# EAGLE design Adafruit_BQ24074 (EAGLE 9.6.2)
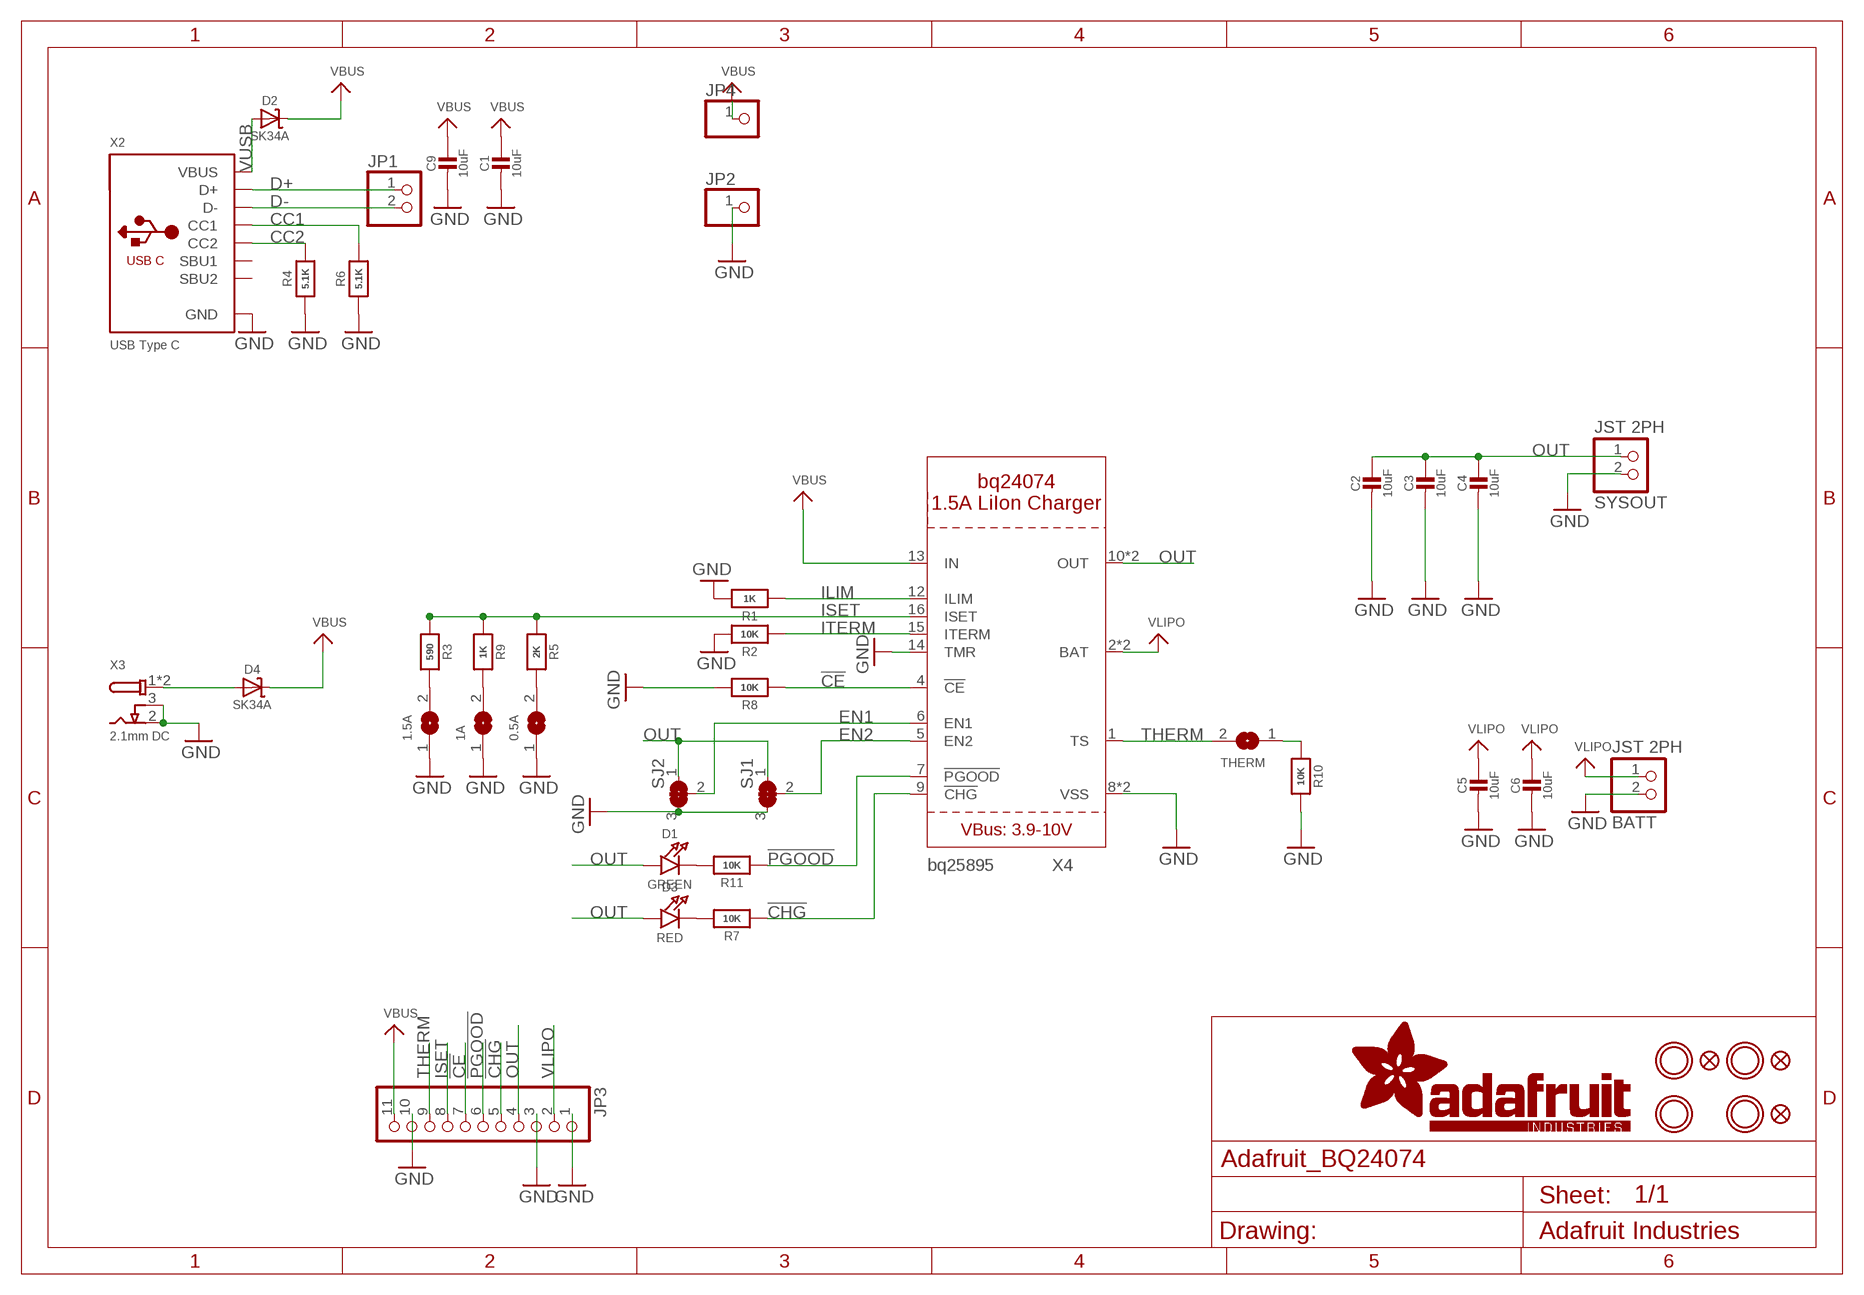
[diagram p0: schematic, sheet 1]

## Parts
0.5A  SOLDERJUMPER  [SOLDERJUMPER_ARROW_NOPASTE]
1.5A  SOLDERJUMPER  [SOLDERJUMPER_ARROW_NOPASTE]
1A  SOLDERJUMPERCLOSED  [SOLDERJUMPER_CLOSEDWIRE]
BATT  JST 2PH  JST_2PIN-SMT-RA  [JST-PH-2-SMT-RA]
C1  10uF  CAP_CERAMIC0805-NOOUTLINE  [0805-NO]
C2  10uF  CAP_CERAMIC0805-NOOUTLINE  [0805-NO]
C3  10uF  CAP_CERAMIC0805-NOOUTLINE  [0805-NO]
C4  10uF  CAP_CERAMIC0805-NOOUTLINE  [0805-NO]
C5  10uF  CAP_CERAMIC0805-NOOUTLINE  [0805-NO]
C6  10uF  CAP_CERAMIC0805-NOOUTLINE  [0805-NO]
C9  10uF  CAP_CERAMIC0805-NOOUTLINE  [0805-NO]
D1  GREEN  LED0603  [CHIPLED_0603]
D2  SK34A  DIODE-SCHOTTKYSMA  [SMADIODE]
D3  RED  LED0603  [CHIPLED_0603]
D4  SK34A  DIODE-SCHOTTKYSMA  [SMADIODE]
FID1  FIDUCIAL_1MM  [FIDUCIAL_1MM]
FID2  FIDUCIAL_1MM  [FIDUCIAL_1MM]
FID3  FIDUCIAL_1MM  [FIDUCIAL_1MM]
JP1  HEADER-1X2ROUND  [1X02_ROUND]
JP2  HEADER-1X1  [1X01_OVAL]
JP3  HEADER-1X1176MIL  [1X11_ROUND_76]
JP4  HEADER-1X1  [1X01_OVAL]
R1  1K  RESISTOR_0603_NOOUT  [0603-NO]
R2  10K  RESISTOR_0603_NOOUT  [0603-NO]
R3  590  RESISTOR_0603_NOOUT  [0603-NO]
R4  5.1K  RESISTOR_0603_NOOUT  [0603-NO]
R5  2K  RESISTOR_0603_NOOUT  [0603-NO]
R6  5.1K  RESISTOR_0603_NOOUT  [0603-NO]
R7  10K  RESISTOR_0603_NOOUT  [0603-NO]
R8  10K  RESISTOR_0603_NOOUT  [0603-NO]
R9  1K  RESISTOR_0603_NOOUT  [0603-NO]
R10  10K  RESISTOR_0603_NOOUT  [0603-NO]
R11  10K  RESISTOR_0603_NOOUT  [0603-NO]
SJ1  SOLDERJUMPER_2WAY  [SOLDERJUMPER_2WAY_OPEN_NOPASTE]
SJ2  SOLDERJUMPER_2WAY  [SOLDERJUMPER_2WAY_OPEN_NOPASTE]
SYSOUT  JST 2PH  JST_2PIN-SMT-RA  [JST-PH-2-SMT-RA]
THERM  SOLDERJUMPERCLOSED  [SOLDERJUMPER_CLOSEDWIRE]
U$3  MOUNTINGHOLE2.5  [MOUNTINGHOLE_2.5_PLATED]
U$4  MOUNTINGHOLE2.5  [MOUNTINGHOLE_2.5_PLATED]
U$11  MOUNTINGHOLE2.5  [MOUNTINGHOLE_2.5_PLATED]
U$12  MOUNTINGHOLE2.5  [MOUNTINGHOLE_2.5_PLATED]
X2  USB Type C  USB_C  [USB_C_CUSB31-CFM2AX-01-X]
X3  2.1mm DC  DCBARRELSMT  [DCJACK_2MM_SMT]
X4  BQ24074  [QFN16_3MM]

## Nets
!CE: JP3.7 R8.1 X4.4(!CE)
!CHG: JP3.5 R7.1 X4.9(!CHG)
!PGOOD: JP3.6 R11.1 X4.7(!PGOOD)
CC1: R6.2 X2.A5(CC1)
CC2: R4.2 X2.B5(CC2)
D+: JP1.1 X2.A6(D+) X2.B6(D+)
D-: JP1.2 X2.A7(D-) X2.B7(D-)
EN1: SJ2.2 X4.6(EN1)
EN2: SJ1.2 X4.5(EN2)
GND: 0.5A.1 1.5A.1 1A.1 BATT.2 C1.2 C2.2 C3.2 C4.2 C5.2 C6.2 C9.2 JP2.1 JP3.1 JP3.3 JP3.10 R1.2 R2.2 R4.1 R6.1 R8.2 R10.2 SJ1.3 SJ2.3 SYSOUT.2 X2.A1B12(GND) X2.B1A12(GND) X3.2(GND) X3.3(GNDBREAK) X4.8(VSS) X4.14(TMR) X4.THERMAL(VSS)
ILIM: R1.1 X4.12(ILIM)
ISET: JP3.8 R3.1 R5.1 R9.1 X4.16(ISET)
ITERM: R2.1 X4.15(ITERM)
N$1: D1.C R11.2
N$2: D4.A X3.1'(PWR) X3.1(PWR)
N$3: D3.C R7.2
N$5: 1.5A.2 R3.2
N$6: 0.5A.2 R5.2
N$7: 1A.2 R9.2
N$9: R10.1 THERM.1
OUT: C2.1 C3.1 C4.1 D1.A D3.A JP3.4 SJ1.1 SJ2.1 SYSOUT.1 X4.10(OUT) X4.11(OUT)
THERM: JP3.9 THERM.2 X4.1(TS)
VBUS: C1.1 C9.1 D2.C D4.C JP3.11 JP4.1 X4.13(IN)
VLIPO: BATT.1 C5.1 C6.1 JP3.2 X4.2(BAT) X4.3(BAT)
VUSB: D2.A X2.A4B9(VBUS) X2.B4A9(VBUS)
Unconnected: X2.A8(SBU1) X2.B8(SBU2)

## Library data of the parts
0.5A 1.5A = microbuilder:SOLDERJUMPER: SMD Solder JUMPER Solder the two pads together to create a connection, or remove the solder to break it. REFLOW - Use this footprint for solder paste and reflow ovens. WAVE - Use this footprint for hand-soldering (larger pads). CLOSED - Has a trace between the two pads to ensure it is closed by default. The trace needs to be cut to disable the jumper, and can be closed again by creating a solder bridge between the two pads.; BOM: EXCLUDE
1A THERM = microbuilder:SOLDERJUMPER: SMD Solder JUMPER Solder the two pads together to create a connection, or remove the solder to break it. REFLOW - Use this footprint for solder paste and reflow ovens. WAVE - Use this footprint for hand-soldering (larger pads). CLOSED - Has a trace between the two pads to ensure it is closed by default. The trace needs to be cut to disable the jumper, and can be closed again by creating a solder bridge between the two pads.
BATT SYSOUT = adafruit:JST_2PIN: JST 2-Pin Connectors of various flavors SMT-RA (S2B-PH-SM4) 4UConnector #17311 SMT (B2B-PH-SM4) THM-RA (S2B-PH) THM (B2B-PH)
C1-C6 C9 = microbuilder:CAP_CERAMIC: Ceramic Capacitors For new designs, use the packages preceded by an '_' character since they are more reliable: The following footprints should be used on most boards: _0402 - Standard footprint for regular board layouts _0603 - Standard footprint for regular board layouts _0805 - Standard footprint for regular board layouts _1206 - Standard footprint for regular board layouts For extremely tight-pitch boards where space is at a premium, the following 'micro-pitch' footprints can be used (smaller pads, no silkscreen outline, etc.): _0402MP - Micro-pitch footprint for very dense/compact boards _0603MP - Micro-pitch footprint for very dense/compact boards _0805MP - Micro-pitch footprint for very dense/compact boards _1206MP - Micro-pitch footprint for very dense/compact boards
D1 D3 = microbuilder:LED: LED 0603 - 0603 Surface Mount Package 2mA: Green LED - Low Power (3.9mcd, 2ma, 1.7Vf) - Digikey: 475-2709-2-ND Orange LED - Low Power (9.8mcd, 2ma, 1.8Vf) - Digikey: 475-1194-2-ND Red LED - Low Power (5mcd, 2ma, 1.8Vf) - Digikey: 475-1195-2-ND Yellow LED - Low Power (7mcd, 2ma, 1.8Vf) - Digikey: 475-1196-2-ND 5mA: Blue LED - Low Power (17mcd, 5ma, 2.9Vf) - Digikey: LNJ937W8CRACT-ND 0805 - 0805 Surface Mount Package 2mA: Red LED (8.8mcd, 2mA, 1.8Vf, Clear) - Low Power [Digikey: 475-2510-1-ND] Green LED (5mcd, 2mA, 1.8Vf, Clear) - Low Power [Digikey: 475-2730-1-ND] Yellow LED (11.3mcd, 2mA, 1.8Vf, Clear) - Low Power [Digikey: 475-2555-1-ND] 20mA: Red LED (104mcd, 20mA, Diffused) - LS R976 [Digikey: 475-1278-6-ND] Red LED (12mcd, 20mA, 2.0Vf, Clear) - APT2012EC [Digikey: 754-1128-1-ND] Green LED (15mcd, 20mA, 2.2Vf, Clear) - APT2012GC [Digikey: 754-1131-1-ND] Orange LED (160mcd, 20mA, 2.1Vf, Clear) - APT2012SECK [Digikey: 754-1130-1-ND] 1206 - 1206 Surface Mount Package Green LED (26mcd, 20mA, Diffused) - LG N971 [Digikey: 475-1407-6-ND] Red LED (15mcd, 20mA, Diffused) - LH N974 [Digikey: 475-1416-6-ND] Cree - Cree High-Power Surface Mount LEDs XPEBWT-L1-0000-00D50 - White 111lm 350mA 2.9Vf 6200K 110° XTEAWT-00-0000-00000LEE3 - White 114lm 350mA 2.85Vf 5000K 115° Everlight - Everlight 45-21 Series Surface Mount LEDs 45-21/QK2C-B2832AC2CB2/2T - Warm White 2000mcd 20mA 3.25Vf 3050K 120° 45-21/LK2C-B38452C4CB2/2T - Nuetral White 2000mcd 20mA 3.25Vf 4150K 120° 45-21/LK2C-B50634C6CB2/2T - Cold White 2200mcd 20mA 3.25Vf 5650K 120° PLCC2 Reverse Mount LS T77K-J1L2-1-0-2-R18-Z - Red 11.25mcd 2mA 1.8Vf 630nm 120° LO T77K-L1M2-24-Z - Orange 19.6mcd 2mA 1.8Vf 606nm 120° LY T77K-K2M1-26-Z - Yellow 15.7mcd 2mA 1.8Vf 587nm 120°
D2 D4 = microbuilder:DIODE-SCHOTTKY
FID1-FID3 = microbuilder:FIDUCIAL: Fiducial Alignment Points Various fiducial points for machine vision alignment.; BOM: EXCLUDE
JP1 = microbuilder:HEADER-1X2: PIN HEADER
JP2 JP4 = microbuilder:HEADER-1X1: PIN HEADER
JP3 = microbuilder:HEADER-1X11
R1-R11 = microbuilder:RESISTOR: Resistors For new designs, use the packages preceded by an '_' character since they are more reliable: The following footprints should be used on most boards: _0402 - Standard footprint for regular board layouts _0603 - Standard footprint for regular board layouts _0805 - Standard footprint for regular board layouts _1206 - Standard footprint for regular board layouts For extremely tight-pitch boards where space is at a premium, the following 'micro-pitch' footprints can be used (smaller pads, no silkscreen outline, etc.): _0402MP - Micro-pitch footprint for very dense/compact boards _0603MP - Micro-pitch footprint for very dense/compact boards _0805MP - Micro-pitch footprint for very dense/compact boards _1206MP - Micro-pitch footprint for very dense/compact boards
SJ1 SJ2 = microbuilder:SOLDERJUMPER_2WAY: 2-Way Solder Jumper
U$3 U$4 U$11 U$12 = microbuilder:MOUNTINGHOLE: Mounting Hole For #2 screws (0.086"/2.18mm width, 0.094"/2.4mm hole) use 2.5mm; BOM: EXCLUDE
X2 = microbuilder:USB_C: USB Type-C USB 2.0 Connector
X3 = microbuilder:DCBARREL: DC Barrel Jack DCJACK_1.3MM_PTH - Through Hole 1.3mm Jack (4UConnector: 05536) DCJACK_2MM_PTH - Through Hole 2.0/2.1 Jack (4UConnector: 05537) DCJACK_2MM_SMT - SMT 2.0/2.1mm Jack(4UConnector: 03267)
X4 = adafruit_power:BQ24074

## Net classes
1 highpower: width 0.305 mm, drill 0.483 mm

## Board
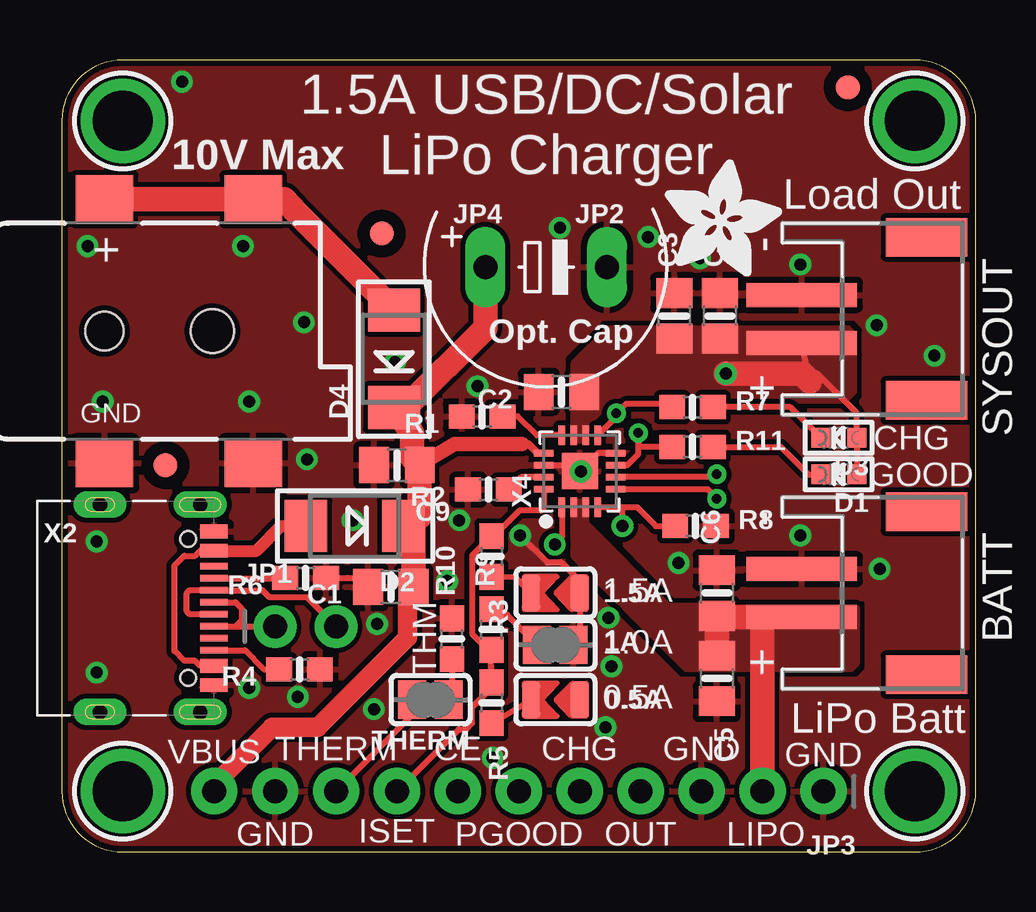
[diagram p1: board, top side]
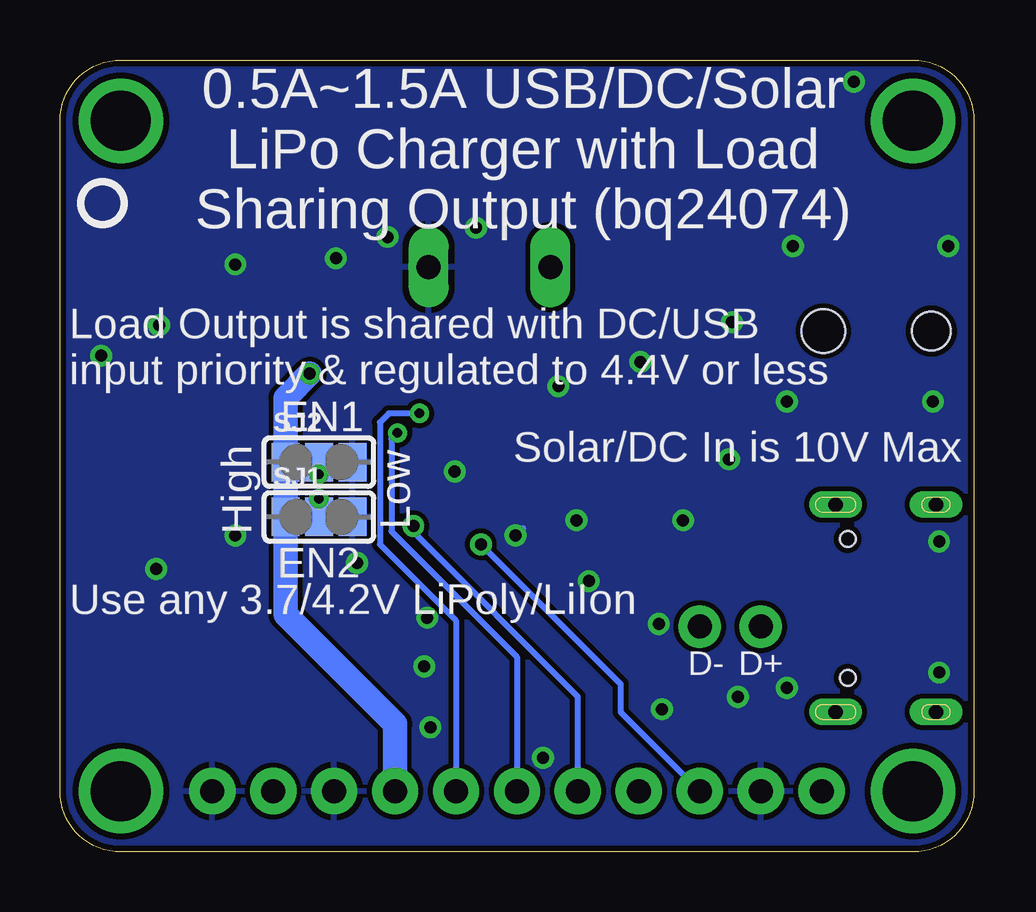
[diagram p2: board, bottom side, seen from below]

Size 38.1 x 33.02 mm. Coordinates in mm from the lower left corner, seen from the top.
Outline: 0,30.48 0,2.54 arc90 2.54,0 35.56,0 arc90 38.1,2.54 38.1,30.48 arc90 35.56,33.02 2.54,33.02 arc90 0,30.48
Copper layers (1*16): Top 0.035mm / dielectric 1.5mm / Bottom 0.035mm
Design rules "adafruit 7-7": minimum track width 6mil, minimum drill 15.5mil, track to track 8mil, track to pad 7mil, pad to pad 7mil, via to via 7mil, smd to smd 7mil, copper to edge 10mil, drill to drill 8mil, minimum pad ring 10mil, minimum via ring 8mil, stop-mask expansion 2mil, vias tented up to drill 20mil, thermal gap 10mil

### Footprints (pad centres in the part's own frame; a part is rotated, then mirrored left to right if it is on the bottom)
SOLDERJUMPER_ARROW_NOPASTE = smd 0.762 x 1.524: 1 -1.016,0; 2 1.016,0
SOLDERJUMPER_CLOSEDWIRE = smd 1.168 x 1.6: 1 -0.762,0; 2 0.762,0 | smd 0.635 x 0.203: WIRE 0,0
JST-PH-2-SMT-RA = smd 1 x 4.6: 1 1,-3.7; 2 -1,-3.7 | smd 1.6 x 3.4: NC1 -3.4,1.5; NC2 3.4,1.5
0805-NO = smd 1.24 x 1.5: 1 -0.95,0; 2 0.95,0
CHIPLED_0603 = smd 0.8 x 0.8: A 0,-0.75; C 0,0.75
SMADIODE = smd 1.778 x 2.159: A 2.019,0; C -2.045,0
FIDUCIAL_1MM = smd 1 x 1: 1 0,0
1X02_ROUND = drill 1 pad 1.778: 1 -1.27,0; 2 1.27,0
1X01_OVAL = drill 1 pad 1.676 long: 1 0,0
1X11_ROUND_76 = drill 1 pad 1.93: 1 -12.7,0; 2 -10.16,0; 3 -7.62,0; 4 -5.08,0; 5 -2.54,0; 6 0,0; 7 2.54,0; 8 5.08,0; 9 7.62,0; 10 10.16,0; 11 12.7,0
0603-NO = smd 1.075 x 1: 1 -0.85,0; 2 0.85,0
SOLDERJUMPER_2WAY_OPEN_NOPASTE = smd 1.168 x 1.6: 1 -1.397,0; 2 0,0; 3 1.397,0
MOUNTINGHOLE_2.5_PLATED = drill 2.5 pad 3.2: P$1 0,0
USB_C_CUSB31-CFM2AX-01-X = smd 0.575 x 1.15: A1B12 -3.2,3.545; A4B9 -2.4,3.545; B1A12 3.2,3.545; B4A9 2.4,3.545 | smd 0.275 x 1.15: A5 -1.25,3.545; A6 -0.25,3.545; A7 0.25,3.545; A8 1.25,3.545; B5 1.75,3.545; B6 0.75,3.545; B7 -0.75,3.545; B8 -1.75,3.545 | drill 0.6 pad 1 long: M1 -4.32,2.97; M2 4.32,2.97; M3 -4.32,-1.21; M4 4.32,-1.21 | hole 0.65: 2.89,2.47; -2.89,2.47
DCJACK_2MM_SMT = smd 2.4 x 2: 1 0,5.5; 1' 6.2,5.5; 2 0,-5.5; 3 6.2,-5.5 | hole 1.6: 0,0 | hole 1.8: 4.5,0
QFN16_3MM = smd 0.8 x 0.28: 1 -1.5,0.75; 2 -1.5,0.25; 3 -1.5,-0.25; 4 -1.5,-0.75; 9 1.5,-0.75; 10 1.5,-0.25; 11 1.5,0.25; 12 1.5,0.75 | smd 0.28 x 0.8: 5 -0.75,-1.5; 6 -0.25,-1.5; 7 0.25,-1.5; 8 0.75,-1.5; 13 0.75,1.5; 14 0.25,1.5; 15 -0.25,1.5; 16 -0.75,1.5 | smd 1.5 x 1.5: THERMAL 0,0

### Placement (x,y rotation side)
0.5A  20.57,6.35 180 top
1.5A  20.57,10.79 180 top
1A  20.57,8.64 180 top
BATT  34.54,10.79 270 top
C1  13.72,11.05 180 top
C2  20.83,19.18 180 top
C3  25.53,22.35 90 top
C4  27.43,22.35 90 top
C5  27.3,7.24 270 top
C6  27.3,10.79 90 top
C9  13.97,16.13 180 top
D1  32.38,15.75 90 top
D2  12.19,13.59 180 top
D3  32.38,17.27 90 top
D4  13.84,20.57 90 top
FID1  13.34,25.78 0 top
FID2  32.77,31.88 0 top
FID3  4.32,16.13 0 top
JP1  10.16,9.4 0 top
JP2  22.73,24.38 0 top
JP3  19.05,2.54 180 top
JP4  17.65,24.38 0 top
R1  17.53,18.16 180 top
R2  17.78,15.11 180 top
R3  17.91,12.32 270 top
R4  9.91,7.62 180 top
R5  17.91,6.22 270 top
R6  10.16,11.43 180 top
R7  26.29,18.54 0 top
R8  26.42,13.59 0 top
R9  17.91,9.27 90 top
R10  16.26,8.89 90 top
R11  26.29,16.89 0 top
SJ1  27.3,13.97 0 bottom
SJ2  27.3,16.26 0 bottom
SYSOUT  34.54,22.23 270 top
THERM  15.37,6.35 180 top
U$3  2.54,2.54 0 top
U$4  2.54,30.48 0 top
U$11  35.56,30.48 0 top
U$12  35.56,2.54 0 top
U$14  [ADAFRUIT_5MM]  25.15,24 0 top
U$18  [PCBFEAT-REV-040]  36.32,27.05 0 bottom
X2  2.79,10.16 270 top
X3  1.78,21.72 0 top
X4  21.59,15.88 90 top

### Tracks (layer width: path | path; a pad name or v marks a point on that pad's centre or on a via)
!CE  (via drill 0.5)
  Top 0.254: X4.4 23.37,14.38 | 23.37,14.38 23.98,14.38 24.77,13.59 R8.1 | v23.37,13.59 23.37,14.38
  Bottom 0.254: JP3.7 16.51,6.48 23.37,13.34 v23.37,13.59
!CHG  (via drill 0.39)
  Top 0.254: X4.9 23.11,18.15 v23.11,18.29 23.5,18.67 25.44,18.67 R7.1
  Bottom 0.254: v23.11,18.29 24.38,18.29 24.77,17.91 24.77,12.83 21.59,9.65 JP3.5
!PGOOD  (via drill 0.39)
  Top 0.254: X4.7 23.57,16.12 24.03,16.58 v24.03,17.47 24.03,16.89 R11.1
  Bottom 0.254: JP3.6 19.05,8.13 24.29,13.37 24.29,17.22 v24.03,17.47
CC1
  Top 0.254: X2.A5 9.29,11.41 R6.2
CC2
  Top 0.254: X2.B5 7.63,8.41 8.42,7.62 R4.2
D+
  Top 0.254: X2.A6 7.24,10.41 7.49,10.16 7.49,9.65 7.25,9.41 | X2.B6 7.25,9.41 | 7.25,9.41 8.88,9.41 JP1.1
D-
  Top 0.254: X2.A7 5.33,9.91 5.21,10.03 5.21,10.79 5.33,10.92 6.33,10.92 X2.B7 8.36,10.91 8.65,10.62 10.2,10.62 JP1.2
EN1  (via drill 0.39)
  Top 0.254: X4.6 27.18,15.62 v27.3,15.75
  Bottom 0.254: SJ2.2 v27.3,15.75
EN2  (via drill 0.39)
  Top 0.254: X4.5 26.91,15.12 v27.3,14.73
  Bottom 0.254: SJ1.2 v27.3,14.73
GND  (via drill 0.5)
  Top 0.254: X4.8 22.34,16.62 X4.THERMAL 21.34,16.12 X4.14 | 1A.1 21.59,8.89 1.5A.1 21.59,11.3 20.83,12.06 20.24,12.06 v19.11,13.2 | R6.1 12.38,11.43 C1.2
  Bottom 0.254: v19.11,13.2 18.8,13.51
  other vias: 17.96,3.92 22.92,7.74 22.79,9.77 25.71,12.05 30.79,13.2 34.09,11.8 30.79,24.5 33.96,21.96 26.6,24.75 24.44,25.64 20.76,26.02 17.33,19.42 12.12,13.83 13.14,9.51 7.8,6.85 9.83,6.46 22.66,5.2 36.38,20.69 13.9,20.43 1.45,7.48 21.65,15.86 16.57,13.83 1.45,12.94 7.8,18.78 1.71,18.78 7.55,25.26 1.07,25.26 5.01,32.12 10.22,16.37 10.09,22.09 16.06,11.29 13.01,5.96
  pour Top (rank 3): 0,0 38.1,0 38.1,33.02 0,33.02
  pour Bottom (rank 3): 0,0 38.1,0 38.1,33.02 0,33.02
ILIM
  Top 0.254: X4.12 19.8,17.38 19.01,18.16 R1.1
ISET
  Top 0.254: X4.16 20.09,14.36 19.96,14.24 19.07,14.24 18.01,13.17 R3.1 17.1,12.36 17.1,9.1 17.81,8.39 | R9.1 17.79,8.53 17.81,8.39 | 17.81,8.39 17.88,7.68 17.91,7.12 | 17.91,7.12 R5.1 | JP3.8 16.55,5.12 16.84,5.12 17.1,5.38 17.1,6.04 17.91,6.84 17.91,7.12
ITERM
  Top 0.254: X4.15 19.14,15.62 R2.1
N$1
  Top 0.254: R11.2 29.97,16.89 31.11,15.75 D1.C
N$2
  Top 1.016: D4.A 9.79,26.65 9.27,27.22 X3.1' X3.1
N$3
  Top 0.254: D3.C 30.36,18.54 R7.2
N$4
  Bottom 0.254: 27.56,13.97 28.45,13.97
N$5
  Top 0.254: 1.5A.2 18.91,11.45 R3.2
N$6
  Top 0.254: R5.2 0.5A.2
N$7
  Top 0.254: R9.2 18.56,9.89 1A.2
N$8
  Bottom 0.254: 27.05,16.26 26.16,16.26
N$9
  Top 0.254: THERM.1 16.26,6.48 R10.1
OUT  (via drill 0.5)
  Top 0.254: 31.18,19.62 SYSOUT.1 | D1.A D3.A 33.13,18.3 31.5,19.94 29.46,19.94
  Top 1.016: v27.69,19.94 29.46,19.94 30.86,19.94 31.18,19.62
  Bottom 0.254: SJ1.1 28.7,14.86
  Bottom 1.016: JP3.4 24.13,5.33 28.7,9.91 SJ1.1 | v27.69,19.94 28.7,18.92 SJ2.1 28.7,14.86
  pour Top (no thermals): 21.84,17.14 21.34,17.14 21.34,20.38 22.8,21.84 32.77,21.84 33.02,21.59 33.02,19.18 32.64,18.8 22.86,18.8 21.84,17.78
THERM  (via drill 0.5)
  Top 0.254: JP3.9 14.61,5.71 THERM.2 | X4.1 20.84,13.11 v20.55,12.82
  Bottom 0.254: v20.55,12.82 14.73,7 14.73,5.84 JP3.9
VBUS
  Top 0.305: 19.18,17.02 19.44,17.02 19.84,16.62 X4.13
  Top 0.61: C9.1 16.37,17.02 19.18,17.02
  Top 0.813: C1.1 14.67,10.54 14.41,10.29 14.41,8.95 10.67,5.21 8.76,5.21 6.35,2.79 JP3.11
  Top 1.016: C1.1 14.67,13.46 D2.C 14.92,13.97 C9.1 14.61,16.44 14.61,17.46 D4.C 14.34,18.53 17.65,21.84 JP4.1
VLIPO
  Top 1.016: JP3.2 29.21,9.65 29.35,9.79 BATT.1 27.36,9.79 C6.1 C5.1
  pour Top (no thermals): 21.34,14.61 21.84,14.61 21.84,13.72 25.27,10.29 26.8,10.29 26.92,10.16 33.15,10.16 33.15,7.87 32.89,7.62 26.04,7.62 21.34,12.32
VUSB
  Top 0.254: X2.B4A9 5.77,7.76 5.56,7.98 5.11,7.98 4.7,8.38 4.7,11.94 5.11,12.34 5.56,12.34 5.77,12.56 X2.A4B9
  Top 0.508: X2.A4B9 8.12,12.56 9.14,13.59 D2.A

### Text on the board
tPlace: 1.5A USB/DC/Solar / LiPo Charger | 10V Max | Load Out | Opt. Cap | CHG | GOOD | 1.5A | THM | 1.0A | 0.5A | LiPo Batt | VBUS | THERM | CE | CHG | GND | GND | GND | ISET | PGOOD | OUT | LIPO
bPlace: 0.5A~1.5A USB/DC/Solar / LiPo Charger with Load / Sharing Output (bq24074) | Load Output is shared with DC/USB / input priority & regulated to 4.4V or less | EN1 | Solar/DC In is 10V Max | Low | High | EN2 | Use any 3.7/4.2V LiPoly/LiIon | D+ | D-